# EAGLE design Sensor_Board_0x07_Heat_Flux_v2 (EAGLE 8.7.0)
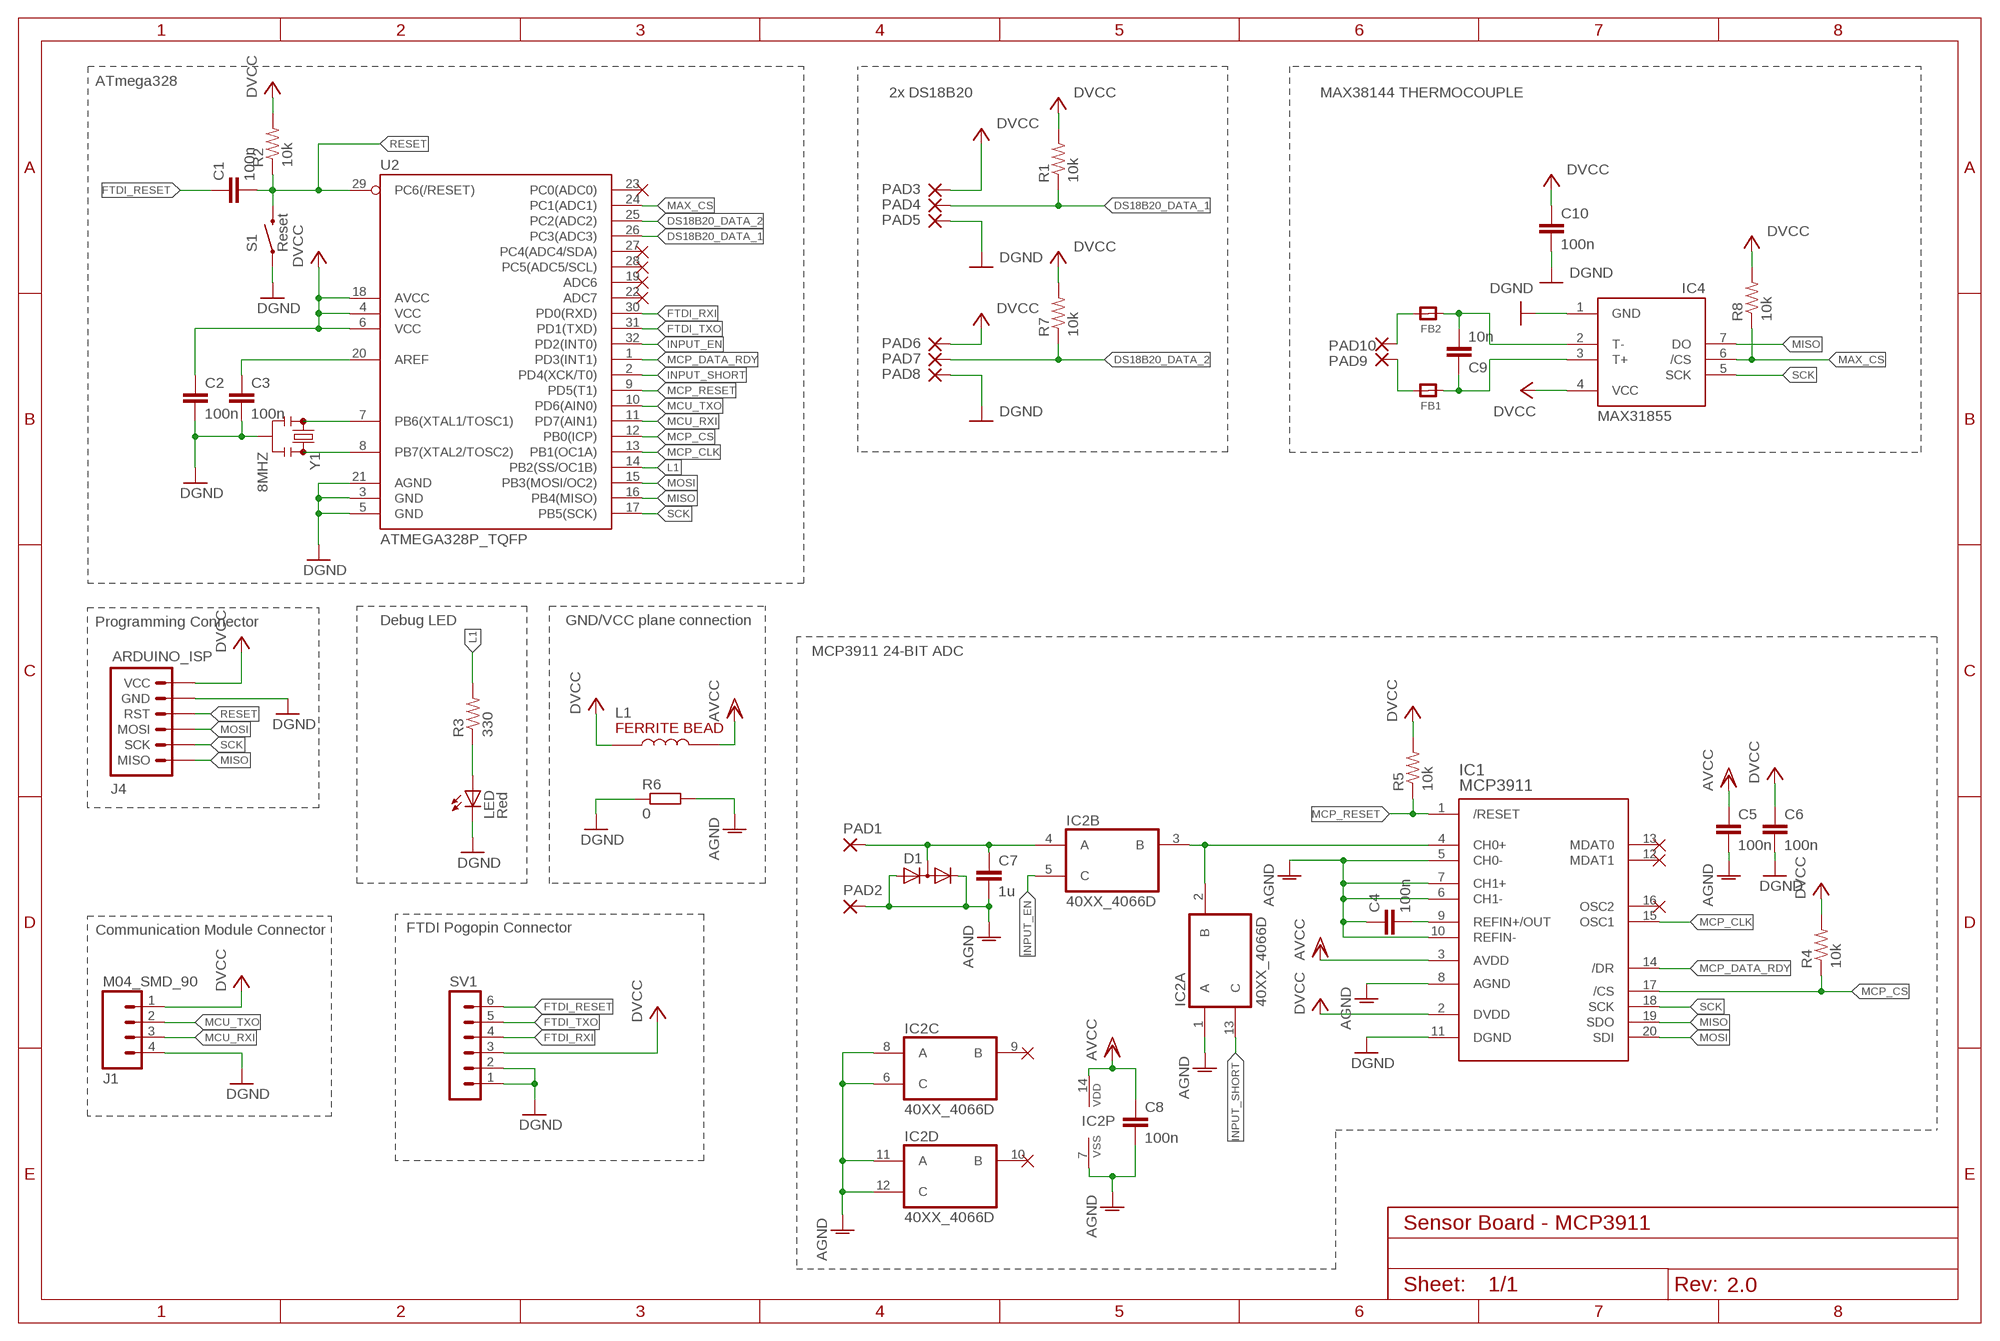
[diagram p0: schematic, sheet 1]
FRAME1 (FRAME-A4L): CNAME: Communication Module; CREVISION: 2.0

## Parts
C1  100n  C  [C0805]
C2  100n  C  [C0805]
C3  100n  C  [C0805]
C4  100n  C  [C0805]
C5  100n  C  [C0805]
C6  100n  C  [C0805]
C7  1u  C  [C0805]
C8  100n  C  [C0805]
C9  10n  C  [C0805]
C10  100n  C  [C0805]
D1  LEDXLAMP_BAV99  [LEDXLAMP_SOT23]
FB1  MICROBUILDER_FERRITE_0805MP  [MICROBUILDER__0805MP]
FB2  MICROBUILDER_FERRITE_0805MP  [MICROBUILDER__0805MP]
IC1  MCP3911  HEATFLOW_MCP3911A0-E/SS  [HEATFLOW_SSOP20]
IC2  40XX_4066D  [40XX_SO14]
IC4  MAX31855  ADAFRUIT_MAX31855  [ADAFRUIT_SO08]
J1  M04_SMD_90  [M04_SMD_90]
J4  ARDUINO_ISP  [M-2X3]
L1  HEATFLOW2_74279220601  [HEATFLOW2_0805]
LED  Red  LEDSML0805  [SML0805]
PAD1  WIREPADSMD1,27-254  [SMD1,27-2,54]
PAD2  WIREPADSMD1,27-254  [SMD1,27-2,54]
PAD3  WIREPADSMD1,27-254  [SMD1,27-2,54]
PAD4  WIREPADSMD1,27-254  [SMD1,27-2,54]
PAD5  WIREPADSMD1,27-254  [SMD1,27-2,54]
PAD6  WIREPADSMD1,27-254  [SMD1,27-2,54]
PAD7  WIREPADSMD1,27-254  [SMD1,27-2,54]
PAD8  WIREPADSMD1,27-254  [SMD1,27-2,54]
PAD9  WIREPADSMD1,27-254  [SMD1,27-2,54]
PAD10  WIREPADSMD1,27-254  [SMD1,27-2,54]
R1  10k  RESISTOR0805-RES  [0805]
R2  10k  RESISTOR0805-RES  [0805]
R3  330  RESISTOR0805-RES  [0805]
R4  10k  RESISTOR0805-RES  [0805]
R5  10k  RESISTOR0805-RES  [0805]
R6  0  RESISTOR_R-EU_M0805  [RESISTOR_M0805]
R7  10k  RESISTOR0805-RES  [0805]
R8  10k  RESISTOR0805-RES  [0805]
S1  Reset  PUSHBUTTON  [M-PUSHBUTTON-SMD]
SV1  MA06-1  [MA06-1]
U2  ATMEGA328P_TQFP  [TQFP32-08]
Y1  8MHZ  RESONATOR8MHZ  [RESONATOR-SMD]

## Nets
AGND: C4.1 C5.2 C7.2 C8.2 D1.1(A) D1.2(C) IC1.5(CH0-) IC1.6(CH1-) IC1.7(CH1+) IC1.8(AGND) IC1.10(REFIN-) IC2.1(A:A) IC2.6(C:C) IC2.7(P:VSS) IC2.8(C:A) IC2.11(D:A) IC2.12(D:C) PAD2.1(P) R6.2
AVCC: C5.1 C8.1 IC1.3(AVDD) IC2.14(P:VDD) L1.2
DGND [GND]: C2.2 C3.2 C6.2 C10.2 IC1.11(DGND) IC4.1(GND) J1.4 J4.P$5(GND) LED.C PAD5.1(P) PAD8.1(P) R6.1 S1.1(LEFT) S1.2(LEFT) SV1.1 SV1.2 U2.3(GND) U2.5(GND) U2.21(AGND) Y1.2
DS18B20_DATA_1: PAD4.1(P) R1.1 U2.26(PC3(ADC3))
DS18B20_DATA_2: PAD7.1(P) R7.1 U2.25(PC2(ADC2))
DVCC [Vsupply]: C2.1 C6.1 C10.1 IC1.2(DVDD) IC4.4(VCC) J1.1 J4.P$6(VCC) L1.1 PAD3.1(P) PAD6.1(P) R1.2 R2.2 R4.2 R5.2 R7.2 R8.2 SV1.3 U2.4(VCC) U2.6(VCC) U2.18(AVCC)
FTDI_RESET: C1.1 SV1.6
FTDI_RXI: SV1.4 U2.30(PD0(RXD))
FTDI_TXO: SV1.5 U2.31(PD1(TXD))
INPUT_EN: IC2.5(B:C) U2.32(PD2(INT0))
INPUT_SHORT: IC2.13(A:C) U2.2(PD4(XCK/T0))
L1: R3.2 U2.14(PB2(SS/OC1B))
MAX_CS: IC4.6(/CS) R8.1 U2.24(PC1(ADC1))
MCP_CLK: IC1.15(OSC1) U2.13(PB1(OC1A))
MCP_CS: IC1.17(/CS) R4.1 U2.12(PB0(ICP))
MCP_DATA_RDY: IC1.14(/DR) U2.1(PD3(INT1))
MCP_RESET: IC1.1(/RESET) R5.1 U2.9(PD5(T1))
MCU_RXI: J1.3 U2.11(PD7(AIN1))
MCU_TXO: J1.2 U2.10(PD6(AIN0))
MISO: IC1.19(SDO) IC4.7(DO) J4.P$1(MISO) U2.16(PB4(MISO))
MOSI: IC1.20(SDI) J4.P$3(MOSI) U2.15(PB3(MOSI/OC2))
N$1: U2.8(PB7(XTAL2/TOSC2)) Y1.3
N$2: U2.7(PB6(XTAL1/TOSC1)) Y1.1
N$3: FB1.1 PAD9.1(P)
N$4: C4.2 IC1.9(REFIN+/OUT)
N$5: IC1.4(CH0+) IC2.2(A:B) IC2.3(B:B)
N$6: C7.1 D1.3(AC) IC2.4(B:A) PAD1.1(P)
N$7: FB2.1 PAD10.1(P)
N$8: C9.2 FB2.2 IC4.2(T-)
N$9: C9.1 FB1.2 IC4.3(T+)
N$15: C3.1 U2.20(AREF)
N$30: LED.A R3.1
RESET: C1.2 J4.P$4(RST) R2.1 S1.3(RIGHT) S1.4(RIGHT) U2.29(PC6(/RESET))
SCK: IC1.18(SCK) IC4.5(SCK) J4.P$2(SCK) U2.17(PB5(SCK))
Unconnected: IC1.12(MDAT1) IC1.13(MDAT0) IC1.16(OSC2) IC2.9(C:B) IC2.10(D:B) U2.19(ADC6) U2.22(ADC7) U2.23(PC0(ADC0)) U2.27(PC4(ADC4/SDA)) U2.28(PC5(ADC5/SCL))

## Notes on the sheet
- ATmega328
- 2x DS18B20 | MAX38144 THERMOCOUPLE
- Programming Connector | Debug LED | GND/VCC plane connection
- MCP3911 24-BIT ADC
- Communication Module Connector | FTDI Pogopin Connector
- Sensor Board - MCP3911
- 2.0

## Library data of the parts
C1-C10 = eagle-ltspice:C: CAPACITOR, European symbol; SPICEMODEL: NONE; SPICEPREFIX: C
D1 = Sensor_Board_0x07_Heat_Flux:LEDXLAMP_BAV99
FB1 FB2 = Adafruit_MAX31855 v2:MICROBUILDER_FERRITE: Ferrite Bead 0603 MMZ1608B121C - 120 Ohm @ 100MHz, 600mA, 0.15 Ohm DC Resistance - Digikey: 445-2164-1-ND BK1608HW121-T - 120 Ohm, 600mA Ferrite Chip - Digikey: 587-1876-2-ND 0805 HZ0805B272R-10 - 2.7K Ohm @ 100MHz, 200mA, 0.8 Ohm DC Resistance - Digikey: 240-2504-1-ND (see also Murata BLM21BD272SN1L) MMZ2012Y152B - 1.5K Ohm @ 100MHz, 500mA, 0.4 Ohm DC Resistance - Digikey: 445-1560-1-ND - Mainly for high frequency (80-400MHz) MMZ2012R102A - 1K Ohm @ 100MHz, 500mA, 0.3 Ohm DC Resistance - Digikey: 445-1555-2-ND - More general purpose (10-200MHz)
IC1 = Sensor_Board_0x07_Heat_Flux:HEATFLOW_MCP3911A0-E/*
IC2 = Sensor_Board_0x07_Heat_Flux:40XX_4066: Quad bilateral ANALOG SWITCH
IC4 = Adafruit_MAX31855 v2:ADAFRUIT_MAX31855
J1 = myownthings:M04_SMD_90
J4 = marc_library:ARDUINO_ISP: AVR ISP 6-pin inline header for Arduino ISP
L1 = Sensor_Board_0x07_Heat_Flux:HEATFLOW2_74279220601: Multilayer Bead SMD, Würth Elektronik Typ: 74279220601
LED = led:LED: LED OSRAM: - CHIPLED LG R971, LG N971, LY N971, LG Q971, LY Q971, LO R971, LY R971 LH N974, LH R974 LS Q976, LO Q976, LY Q976 LO Q996 - Hyper CHIPLED LW Q18S LB Q993, LB Q99A, LB R99A - SideLED LS A670, LO A670, LY A670, LG A670, LP A670 LB A673, LV A673, LT A673, LW A673 LH A674 LY A675 LS A676, LA A676, LO A676, LY A676, LW A676 LS A679, LY A679, LG A679 - Hyper Micro SIDELED® LS Y876, LA Y876, LO Y876, LY Y876 LT Y87S - SmartLED LW L88C, LW L88S LB L89C, LB L89S, LG L890 LS L89K, LO L89K, LY L89K LS L896, LA L896, LO L896, LY L896 - TOPLED LS T670, LO T670, LY T670, LG T670, LP T670 LSG T670, LSP T670, LSY T670, LOP T670, LYG T670 LG T671, LOG T671, LSG T671 LB T673, LV T673, LT T673, LW T673 LH T674 LS T676, LA T676, LO T676, LY T676, LB T676, LH T676, LSB T676, LW T676 LB T67C, LV T67C, LT T67C, LS T67K, LO T67K, LY T67K, LW E67C LS E67B, LA E67B, LO E67B, LY E67B, LB E67C, LV E67C, LT E67C LW T67C LS T679, LY T679, LG T679 LS T770, LO T770, LY T770, LG T770, LP T770 LB T773, LV T773, LT T773, LW T773 LH T774 LS E675, LA E675, LY E675, LS T675 LS T776, LA T776, LO T776, LY T776, LB T776 LHGB T686 LT T68C, LB T68C - Hyper Mini TOPLED® LB M676 - Mini TOPLED Santana® LG M470 LS M47K, LO M47K, LY M47K Source: http://www.osram.convergy.de LUXEON: - LUMILED® LXK2-PW12-R00, LXK2-PW12-S00, LXK2-PW14-U00, LXK2-PW14-V00 LXK2-PM12-R00, LXK2-PM12-S00, LXK2-PM14-U00 LXK2-PE12-Q00, LXK2-PE12-R00, LXK2-PE12-S00, LXK2-PE14-T00, LXK2-PE14-U00 LXK2-PB12-K00, LXK2-PB12-L00, LXK2-PB12-M00, LXK2-PB14-N00, LXK2-PB14-P00, LXK2-PB14-Q00 LXK2-PR12-L00, LXK2-PR12-M00, LXK2-PR14-Q00, LXK2-PR14-R00 LXK2-PD12-Q00, LXK2-PD12-R00, LXK2-PD12-S00 LXK2-PH12-R00, LXK2-PH12-S00 LXK2-PL12-P00, LXK2-PL12-Q00, LXK2-PL12-R00 Source: www.luxeon.com KINGBRIGHT: KA-3528ASYC Source: www.kingbright.com
PAD1-PAD10 = wirepad:WIREPAD: Wire PAD connect wire on PCB
R1-R5 R7 R8 = SparkFun-Passives:RESISTOR: Resistor Basic schematic elements and footprints for 0603, 1206, and PTH resistors.
R6 = Sensor_Board_0x07_Heat_Flux:RESISTOR_R-EU_: RESISTOR, European symbol
S1 = marc_library:PUSHBUTTON
SV1 = con-lstb:MA06-1: PIN HEADER; OC_FARNELL: unknown; OC_NEWARK: unknown
U2 = marc_library:ATMEGA328P_TQFP; PROD_ID: IC-09069
Y1 = marc_library:RESONATOR: Resonator Small SMD resonator. Used, eg, on the Arduino Pro/ Pro Mini boards. 8MHz- XTAL-08895 16MHz- XTAL-08900; PROD_ID: XTAL-08895

## Net classes
0 default: width 0.3 mm
1 Vsupply: width 0.5 mm
5 GND: width 0.5 mm

## Board
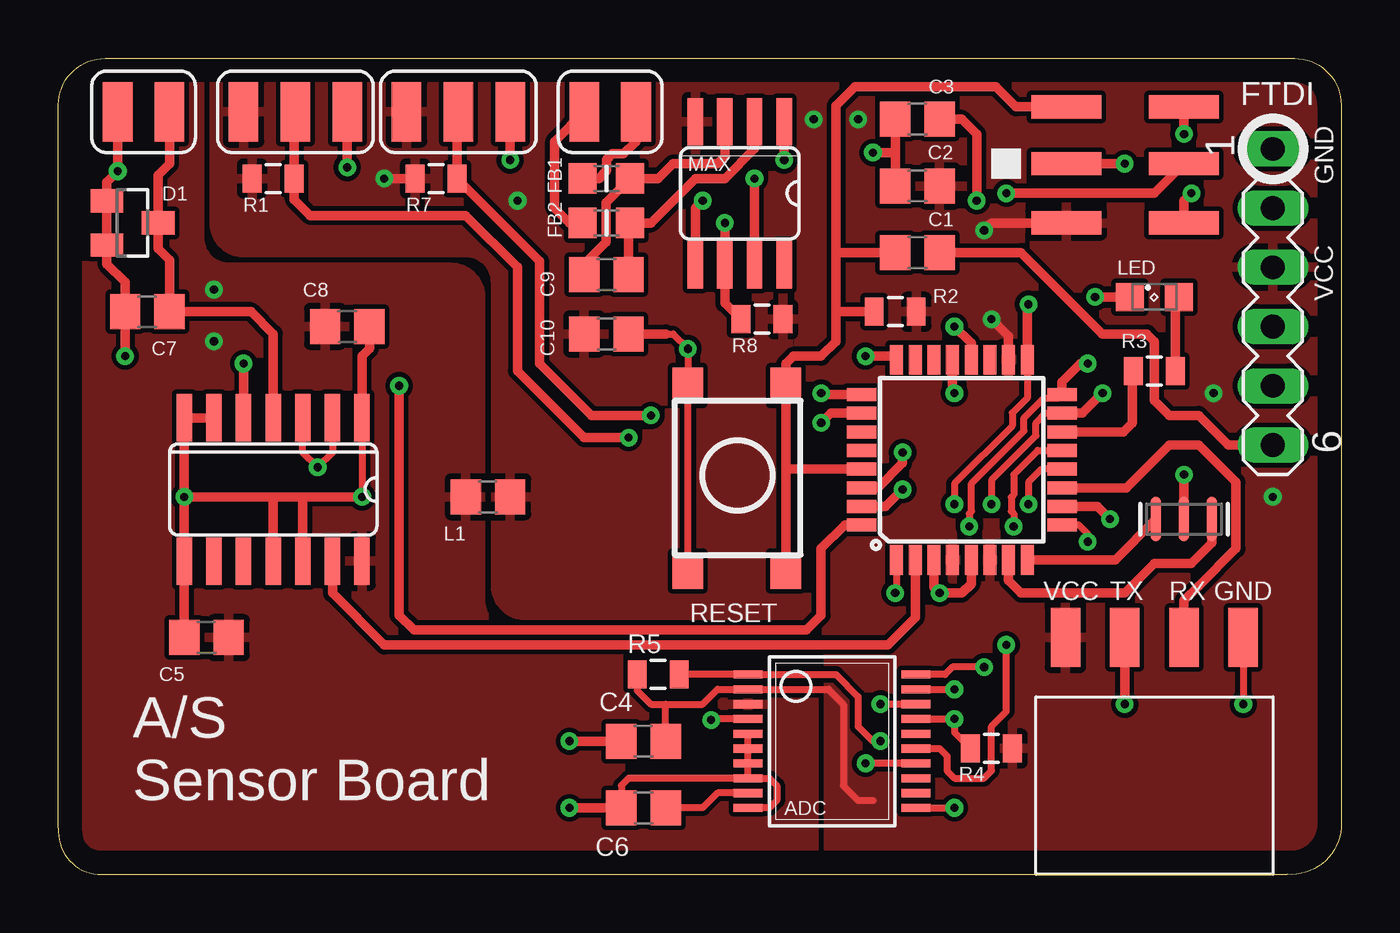
[diagram p1: board, top side]
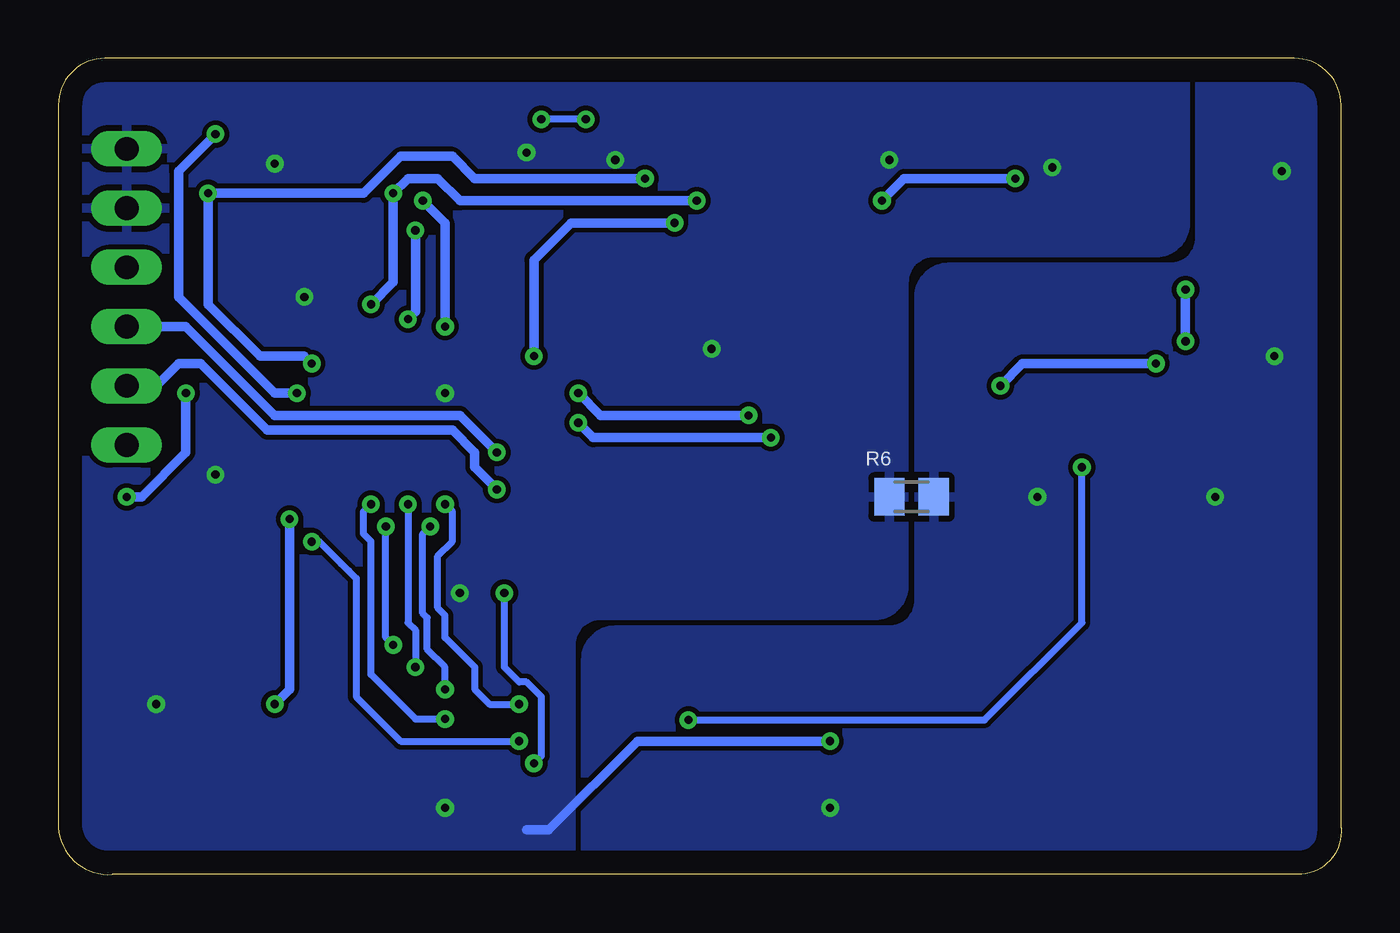
[diagram p2: board, bottom side, seen from below]

Size 55.01 x 35.01 mm. Coordinates in mm from the lower left corner, seen from the top.
Outline: 2.01,35.01 53.01,35.01 arc-90 55.01,33.01 55.01,2.01 arc-90 52.69,0.01 1.69,0.01 arc-90 0.01,2.01 0.01,33.01 arc-90 2.01,35.01
Copper layers (1*16): Top 0.035mm / dielectric 1.5mm / Bottom 0.035mm
Design rules "default *": minimum track width 14mil, minimum drill 24mil, track to track 8mil, track to pad 8mil, pad to pad 8mil, via to via 8mil, smd to smd 8mil, copper to edge 40mil, drill to drill 8mil, minimum pad ring 10mil, minimum via ring 8mil, stop-mask expansion 4mil, vias tented up to drill 0mil, thermal gap 10mil

### Footprints (pad centres in the part's own frame; a part is rotated, then mirrored left to right if it is on the bottom)
C0805 = smd 1.3 x 1.5: 1 -0.95,0; 2 0.95,0
LEDXLAMP_SOT23 = smd 1 x 1.4: 1 -0.95,-1.1; 2 0.95,-1.1; 3 0,1.1
MICROBUILDER__0805MP = smd 1.2 x 1.3: 1 -1.016,0; 2 1.016,0
HEATFLOW_SSOP20 = smd 0.35 x 1.245: 1 -2.857,-3.45; 2 -2.222,-3.45; 3 -1.587,-3.45; 4 -0.952,-3.45; 5 -0.317,-3.45; 6 0.318,-3.45; 7 0.953,-3.45; 8 1.588,-3.45; 9 2.223,-3.45; 10 2.858,-3.45; 11 2.858,3.75; 12 2.223,3.75; 13 1.588,3.75; 14 0.953,3.75; 15 0.318,3.75; 16 -0.317,3.75; 17 -0.952,3.75; 18 -1.587,3.75; 19 -2.222,3.75; 20 -2.857,3.75
40XX_SO14 = smd 0.66 x 2.032: 1 -3.81,-3.073; 2 -2.54,-3.073; 3 -1.27,-3.073; 4 0,-3.073; 5 1.27,-3.073; 6 2.54,-3.073; 7 3.81,-3.073; 8 3.81,3.073; 9 2.54,3.073; 10 1.27,3.073; 11 0,3.073; 12 -1.27,3.073; 13 -2.54,3.073; 14 -3.81,3.073
ADAFRUIT_SO08 = smd 0.66 x 2.032: 1 -1.905,-3.073; 2 -0.635,-3.073; 3 0.635,-3.073; 4 1.905,-3.073; 5 1.905,3.073; 6 0.635,3.073; 7 -0.635,3.073; 8 -1.905,3.073
M04_SMD_90 = smd 1.27 x 2.54: 1 0,0; 2 2.54,0; 3 5.08,0; 4 7.62,0
M-2X3 = smd 1 x 3: P$1 0,0; P$2 2.54,0; P$3 4.98,0; P$4 4.98,5.05; P$5 2.54,5.05; P$6 0,5.05
HEATFLOW2_0805 = smd 1.3 x 1.5: 1 -0.95,0; 2 0.95,0
SML0805 = smd 1.2 x 1.2: A 1.05,0; C -1.05,0
SMD1,27-2,54 = smd 1.27 x 2.54: 1 0,0
0805 = smd 0.8 x 1.2: 1 -0.9,0; 2 0.9,0
RESISTOR_M0805 = smd 1.3 x 1.6: 1 -0.95,0; 2 0.95,0
M-PUSHBUTTON-SMD = smd 1.55 x 1.3: 1 0,0; 2 7.95,0; 3 0,-4.2; 4 7.95,-4.2
MA06-1 = drill 1.016 long: 1 -6.35,0; 2 -3.81,0; 3 -1.27,0; 4 1.27,0; 5 3.81,0; 6 6.35,0
TQFP32-08 = smd 1.27 x 0.559: 1 -4.293,2.8; 2 -4.293,2; 3 -4.293,1.2; 4 -4.293,0.4; 5 -4.293,-0.4; 6 -4.293,-1.2; 7 -4.293,-2; 8 -4.293,-2.8; 17 4.293,-2.8; 18 4.293,-2; 19 4.293,-1.2; 20 4.293,-0.4; 21 4.293,0.4; 22 4.293,1.2; 23 4.293,2; 24 4.293,2.8 | smd 0.559 x 1.27: 9 -2.8,-4.293; 10 -2,-4.293; 11 -1.2,-4.293; 12 -0.4,-4.293; 13 0.4,-4.293; 14 1.2,-4.293; 15 2,-4.293; 16 2.8,-4.293; 25 2.8,4.293; 26 2,4.293; 27 1.2,4.293; 28 0.4,4.293; 29 -0.4,4.293; 30 -1.2,4.293; 31 -2,4.293; 32 -2.8,4.293
RESONATOR-SMD = smd 0.45 x 1.905: 1 -1.2,0; 2 0,0; 3 1.2,0

### Placement (x,y rotation side)
C1  36.84,26.68 180 top
C2  36.84,29.53 180 top
C3  36.84,32.39 180 top
C4  25.09,2.86 0 top
C5  6.36,10.17 180 top
C6  25.09,5.72 180 top
C7  3.82,24.14 180 top
C8  12.39,23.5 0 top
C9  23.5,25.72 0 top
C10  23.5,23.18 0 top
D1  3.18,27.95 270 top
FB1  23.5,29.85 0 top
FB2  23.5,27.95 0 top
IC1  HEATFLOW_MCP3911A0-E/SS  [HEATFLOW_SSOP20]  33.03,5.72 270 top
IC2  9.21,16.52 180 top
IC4  ADAFRUIT_MAX31855  [ADAFRUIT_SO08]  29.22,29.22 180 top
J1  43.19,10.17 0 top
J4  48.27,27.95 90 top
L1  18.42,16.2 180 top
LED  47,24.77 0 top
PAD1  4.77,32.71 0 top
PAD2  2.55,32.71 0 top
PAD3  7.94,32.71 180 top
PAD4  10.17,32.71 180 top
PAD5  12.39,32.71 180 top
PAD6  14.93,32.71 180 top
PAD7  17.15,32.71 180 top
PAD8  19.37,32.71 180 top
PAD9  24.77,32.71 0 top
PAD10  22.55,32.71 0 top
R1  9.21,29.85 180 top
R2  35.88,24.14 0 top
R3  47,21.6 180 top
R4  40.01,5.4 0 top
R5  25.72,8.58 180 top
R6  18.42,16.2 0 bottom
R7  16.2,29.85 180 top
R8  30.17,23.82 0 top
S1  26.99,13.02 90 top
SV1  52.08,24.77 270 top
U2  38.74,17.79 90 top
Y1  48.27,15.25 180 top

### Tracks (layer width: path | path; a pad name or v marks a point on that pad's centre or on a via)
AGND  (via drill 0.35)
  Top 0.305: IC2.1 v13.02,16.2 | IC1.8 24.45,4.13 24.14,3.82 24.14,3.81 C4.1 | IC1.8 IC1.7 IC1.6 IC1.5 | IC1.8 30.49,4.13 30.8,3.82 30.8,3.18 30.49,2.86 IC1.10
  Top 0.406: v13.02,16.2 10.48,16.2 | 10.48,16.2 9.21,16.2 | 9.21,16.2 v5.4,16.2 | 10.48,16.2 IC2.12 | 9.21,16.2 IC2.11 | 2.23,29.04 D1.1 | D1.1 D1.2 2.08,26.19 2.86,25.41 C7.2 v2.87,22.23 v2.86,22.23 | IC2.1 13.02,22.23 13.34,22.55 13.34,22.86 C8.2 | v21.91,2.86 C4.1 | C5.2 5.4,11.12 IC2.8 v5.4,16.2 | IC2.6 IC2.7 v5.4,16.2 | D1.1 2.08,29.7 v2.55,30.17 PAD2.1
  pour Bottom: 0.01,0.01 0.01,35 6.06,35 6.06,27.31 arc90 7.33,26.04 16.83,26.04 arc-90 18.1,24.77 18.1,11.75 arc90 19.37,10.48 31.12,10.48 arc-90 32.39,9.21 32.39,0.01
AVCC  (via drill 0.35)
  Bottom 0.406: v6.67,25.09 v6.67,22.87
  pour Top: 0.01,0.01 0.01,35 6.06,35 6.06,27.31 arc90 7.33,26.04 16.83,26.04 arc-90 18.1,24.77 18.1,11.75 arc90 19.37,10.48 31.12,10.48 arc-90 32.39,9.21 32.39,0.01
DGND  (via drill 0.35)
  Top 0.305: 26.05,23.18 26.36,23.18 v26.99,22.55 S1.2 S1.1 | IC1.11 v38.42,2.86 | v38.42,2.86 | J1.4 v50.81,7.31
  Top 0.406: v48.27,17.15 Y1.2 | v44.46,24.77 LED.C | v34.93,30.96 35.88,30.96 35.89,30.96 | C3.2 35.89,30.96 | 35.89,30.96 C2.2 | J4.P$5 v45.73,30.49 | C10.2 26.05,23.18 | v31.12,30.64 IC4.1 | v12.39,30.33 PAD5.1 | U2.5 39.14,12.47 38.74,12.07 v37.79,12.07 37.54,12.32 U2.3 | U2.21 38.34,20.73 v38.42,20.64 | C6.2 v21.91,5.72 | v19.37,30.64 PAD8.1
  Bottom 0.406: v21.91,5.72 30.17,5.72 33.98,1.91 34.93,1.91
  pour Bottom: 33.03,0.01 55.02,0.01 55.02,35 6.67,35 6.67,27.95 arc90 7.94,26.68 17.47,26.68 arc-90 18.74,25.41 18.74,12.39 arc90 20.01,11.12 31.76,11.12 arc-90 33.03,9.85
DS18B20_DATA_1  (via drill 0.35)
  Top 0.406: v24.45,18.74 22.55,18.74 19.69,21.6 19.69,26.04 17.47,28.26 10.8,28.26 10.11,28.95 R1.1 10.11,32.66 PAD4.1 | v32.71,19.37 33.12,19.79 U2.26
  Bottom 0.406: v24.45,18.74 32.07,18.74 v32.71,19.37
DS18B20_DATA_2  (via drill 0.35)
  Top 0.406: PAD7.1 17.1,32.66 R7.1 20.64,26.31 20.64,21.91 22.87,19.69 v25.41,19.69 | U2.25 32.77,20.59 v32.71,20.64
  Bottom 0.406: v25.41,19.69 31.76,19.69 v32.71,20.64
DVCC  (via drill 0.35)
  Top 0.305: 34.93,3.18 34.3,3.18 33.66,3.82 33.66,7.31 33.03,7.94 IC1.2 28.26,7.94 27.63,7.31 26.04,7.31 | R5.2 24.82,7.89 25.41,7.31 26.04,7.31 | C6.1 26.04,7.31
  Top 0.406: v40.01,23.82 40.74,23.09 U2.18 | v39.69,27.63 40.01,27.95 J4.P$6 | R7.2 v13.98,29.85
  Bottom 0.305: v32.39,32.39 v34.3,32.39
  Bottom 0.406: v39.69,27.63 39.69,24.14 v40.01,23.82 | v13.98,29.85 18.74,29.85 v19.69,28.9 | v49.54,20.64 49.54,18.1 51.44,16.2 v52.08,16.2
  pour Top: 33.03,0.01 55.02,0.01 55.02,35 6.67,35 6.67,27.95 arc90 7.94,26.68 17.47,26.68 arc-90 18.74,25.41 18.74,12.39 arc90 20.01,11.12 31.76,11.12 arc-90 33.03,9.85
FTDI_RESET
  Top 0.406: C1.1 41.28,26.68 44.77,23.18 46.68,23.18 47,22.87 47,20.33 47.63,19.69 48.9,19.69 50.17,18.42 SV1.6
FTDI_RXI  (via drill 0.35)
  Top 0.406: U2.30 35.14,16.59 36.2,17.65 v36.2,18.1
  Bottom 0.406: 51.76,23.5 SV1.4 49.54,23.5 45.73,19.69 37.79,19.69 v36.2,18.1
FTDI_TXO  (via drill 0.35)
  Top 0.406: U2.31 35.47,15.79 v36.2,16.52
  Bottom 0.406: SV1.5 50.81,20.96 49.85,21.91 48.9,21.91 46.04,19.06 38.11,19.06 37.15,18.1 37.15,17.47 v36.2,16.52
INPUT_EN  (via drill 0.35)
  Top 0.406: U2.32 33.72,14.99 32.71,13.98 32.71,11.12 32.07,10.48 15.25,10.48 14.61,11.12 v14.61,20.96 | v7.94,21.91 IC2.5
  Bottom 0.406: v14.61,20.96 13.66,21.91 v7.94,21.91
INPUT_SHORT
  Top 0.406: IC2.13 11.75,12.07 13.98,9.85 35.57,9.85 36.74,11.02 U2.2
L1
  Top 0.406: U2.14 45.66,18.99 46.04,19.37 46.04,21.54 R3.2
MAX_CS  (via drill 0.35)
  Top 0.406: v28.58,27.95 IC4.6 28.58,24.51 R8.1 | U2.24 35.79,22.23 v34.61,22.23
  Bottom 0.406: v28.58,27.95 33.03,27.95 34.61,26.36 v34.61,22.23
MCP_CLK  (via drill 0.35)
  Top 0.305: U2.13 42,18.19 40.96,17.15 40.96,16.28 40.87,16.18 40.87,15.58 40.96,15.48 v40.96,14.93 | v40.65,9.85 40.65,6.99 40.01,6.36 40.01,4.45 39.69,4.13 38.42,4.13 38.11,4.45 38.11,5.09 37.79,5.4 IC1.15
  Bottom 0.305: v40.65,9.85 40.96,10.17 v40.96,14.93
MCP_CS  (via drill 0.35)
  Top 0.305: U2.12 42.15,17.39 41.6,16.83 v41.6,15.88 | IC1.17 v38.42,6.67 38.42,6.09 R4.1
  Bottom 0.305: v38.42,6.67 39.69,6.67 41.6,8.58 41.6,14.29 41.92,14.61 41.92,15.56 v41.6,15.88
MCP_DATA_RDY  (via drill 0.35)
  Top 0.305: U2.1 35.94,12.13 v35.88,12.07 | IC1.14 v34.61,4.77
  Bottom 0.305: v35.88,12.07 35.88,8.9 35.25,8.26 34.93,8.26 34.3,7.63 34.3,5.09 v34.61,4.77
MCP_RESET  (via drill 0.35)
  Top 0.305: v35.25,5.72 34.93,5.72 34.3,6.36 34.3,7.63 33.34,8.58 IC1.1 26.94,8.58 R5.1 | v44.14,14.28 44.14,14.61 43.76,14.99 U2.9
  Bottom 0.305: v35.25,5.72 40.33,5.72 42.23,7.63 42.23,12.71 42.55,13.02 42.88,13.34 43.82,14.28 v44.14,14.28
MCU_RXI
  Top 0.406: U2.11 45.8,16.59 47.63,18.42 48.9,18.42 50.49,16.83 50.49,13.98 48.9,12.39 48.27,11.75 J1.3
MCU_TXO  (via drill 0.35)
  Top 0.406: U2.10 44.55,15.79 v45.09,15.25 | v45.73,7.31 J1.2
  Bottom 0.406: v45.09,15.25 45.09,7.94 v45.73,7.31
MISO  (via drill 0.35)
  Top 0.305: U2.16 42.87,20.42 42.25,20.42 41.41,19.58 41.41,19.03 39.16,16.78 39.16,15.58 39.06,15.48 v39.06,14.93 | IC1.19 v38.42,7.94
  Top 0.406: J4.P$1 48.27,28.9 v48.58,29.22 | U2.16 43.03,21.13 43.82,21.91 v44.14,21.91 | IC4.7 v29.85,29.85
  Bottom 0.305: v38.42,7.94 38.42,8.9 39.19,9.66 39.19,11.01 39.38,11.2 39.38,14.61 v39.06,14.93
  Bottom 0.406: v44.14,21.91 44.46,22.23 46.36,22.23 48.58,24.45 v48.58,29.22 41.92,29.22 40.33,30.8 38.11,30.8 37.15,29.85 v29.85,29.85
MOSI  (via drill 0.35)
  Top 0.305: U2.15 42.33,19.79 41.92,19.37 41.92,18.82 40.01,16.92 v40.01,15.88 | IC1.20 | IC1.20 38.02,8.58 38.34,8.9 v39.69,8.9
  Top 0.406: J4.P$3 v48.27,31.76 | v44.77,20.64 43.92,19.79 U2.15
  Bottom 0.305: v40.01,15.88 40.01,10.8 39.69,10.48 v39.69,8.9
  Bottom 0.406: v48.27,31.76 49.85,30.17 49.85,24.77 45.73,20.64 v44.77,20.64
N$1
  Top 0.406: Y1.3 45.31,13.49 U2.8
N$2
  Top 0.406: Y1.1 49.47,14.22 48.58,13.34 47,13.34 45.73,12.07 41.28,12.07 40.74,12.61 U2.7
N$3
  Top 0.406: FB1.1 23.18,29.85 23.51,30.18 23.51,30.67 23.75,30.91 24.24,30.91 24.77,31.44 PAD9.1
N$4
  Top 0.305: IC1.9 28.26,3.5 27.63,2.86 C4.2
N$5  (via drill 0.35)
  Top 0.305: IC1.4 28.03,6.67 v27.99,6.63 | IC2.2 11.75,18.1 v11.12,17.47 10.48,18.1 IC2.3
  Bottom 0.305: v27.99,6.63 15.29,6.63 11.12,10.8 v11.12,17.47
N$6
  Top 0.406: PAD1.1 4.77,30.49 4.28,30 D1.3 4.28,26.85 4.77,26.36 C7.1 8.26,24.14 9.21,23.18 IC2.4
N$7
  Top 0.406: FB2.1 21.91,27.95 21.28,28.58 21.28,31.44 PAD10.1 22.23,31.76
N$8
  Top 0.406: IC4.2 29.85,31.12 28.58,29.85 27.31,29.85 25.41,27.95 FB2.2 24.45,27.88 C9.2
N$9
  Top 0.406: IC4.3 28.58,30.8 28.26,30.49 26.36,30.49 25.72,29.85 FB1.2 23.49,28.82 23.49,27.13 22.55,26.19 C9.1
N$15  (via drill 0.35)
  Top 0.406: v38.42,23.5 39.14,22.78 U2.20 | C3.1 38.74,32.39 39.38,31.76 v39.38,28.9
  Bottom 0.406: v38.42,23.5 38.42,27.95 v39.38,28.9
N$30
  Top 0.406: R3.1 47.9,24.62 LED.A
RESET
  Top 0.406: J4.P$4 41.06,32.93 40.2,33.79 34.16,33.79 33.34,32.97 33.34,26.68 | S1.3 31.19,17.47 | 31.19,17.47 S1.4 31.19,21.91 31.51,22.23 32.71,22.23 33.34,22.87 33.34,24.14 | U2.29 31.28,17.39 31.19,17.47 | 33.34,26.68 33.34,24.14 | 33.34,24.14 R2.1 | 33.34,26.68 C1.2
SCK  (via drill 0.35)
  Top 0.305: U2.17 41.54,20.43 40.9,19.79 40.9,19.24 38.42,16.77 v38.42,15.88 | IC1.18 35.57,7.31 v35.25,7.31
  Top 0.406: J4.P$2 47,29.22 v40.65,29.22 | U2.17 41.54,24.4 v41.6,24.45 | IC4.5 27.31,28.58 v27.63,28.9
  Bottom 0.305: v35.25,7.31 36.52,7.31 37.15,7.94 37.15,8.9 38.42,10.17 38.42,11.12 38.74,11.44 38.74,13.66 38.11,14.29 38.11,15.56 v38.42,15.88
  Bottom 0.406: v41.6,24.45 40.65,25.41 v40.65,29.22 40.01,29.85 38.74,29.85 37.79,28.9 v27.63,28.9

### Text on the board
tPlace: FTDI | GND | MAX | VCC | RESET | VCC | TX | RX | GND | A/S / Sensor Board | ADC
bPlace: RESET